# EAGLE design zumo_cc (EAGLE 9.5.2)
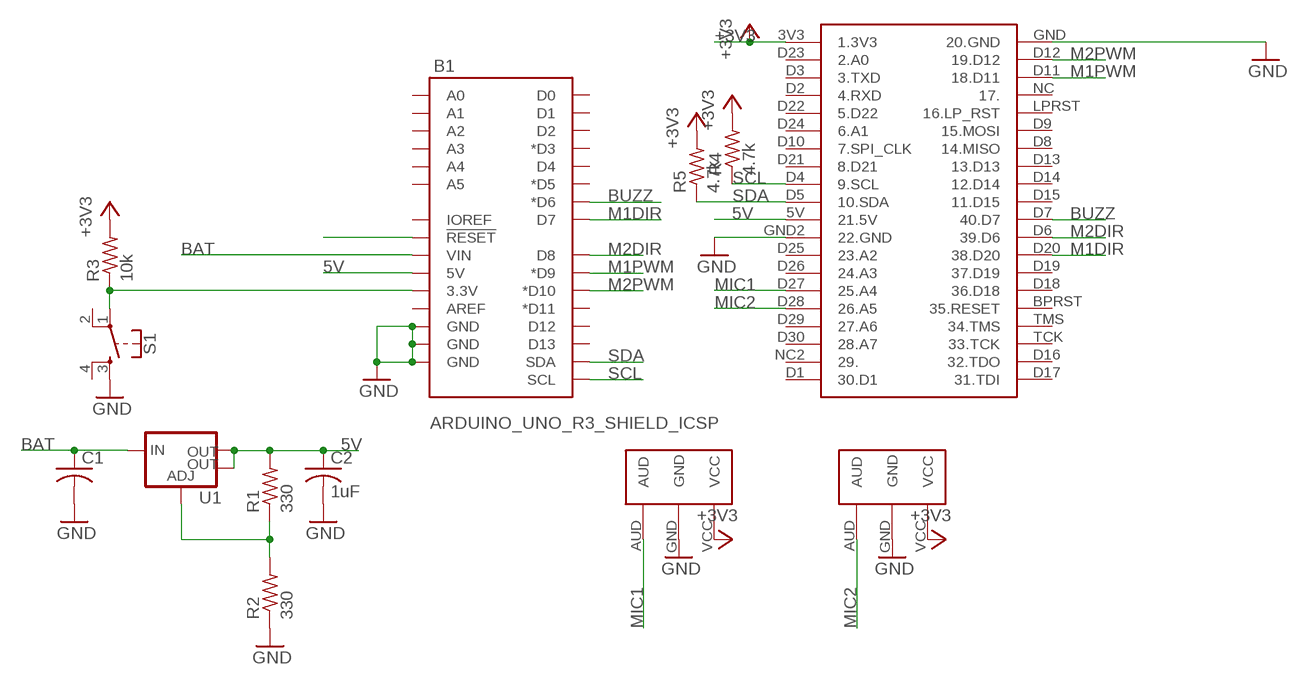
[diagram p0: schematic, sheet 1]

## Parts
B1  ARDUINO_UNO_R3_SHIELD_ICSP  [UNO_R3_SHIELD_ICSP]
C1  1uF  C-USC0603  [C0603]
C2  1uF  C-USC0603  [C0603]
R1  330  R-US_R0603  [R0603]
R2  330  R-US_R0603  [R0603]
R3  10k  R-US_R0603  [R0603]
R4  4.7k  R-US_R0603  [R0603]
R5  4.7k  R-US_R0603  [R0603]
S1  MOMENTARY-SWITCH-SPST-2-SMD-5.2MM  [TACTILE_SWITCH_SMD_5.2MM]
U1  NU32V7_V_REG_LM1117SOT223  [NU32V7_SOT223]
U$1  CC1310_INT  [CC1310_INT]
U$2  ANALOG_MIC  [ANALOG_MIC]
U$3  ANALOG_MIC  [ANALOG_MIC]

## Nets
5V: B1.5V C2.1 R1.2 U1.OUTPUT(OUT) U1.VOUT(OUT) U$1.5V(21.5V)
+3V3: R3.2 R4.2 R5.2 U$1.3V3(1.3V3) U$2.VCC U$3.VCC
BAT: B1.VIN C1.1 U1.INPUT(IN)
BUZZ: B1.D6(*D6) U$1.D7(40.D7)
GND: B1.GND@0(GND) B1.GND@1(GND) B1.GND@2(GND) C1.2 C2.2 R2.1 S1.3 U$1.GND2(22.GND) U$1.GND(20.GND) U$2.GND U$3.GND
M1DIR: B1.D7 U$1.D20(38.D20)
M1PWM: B1.D9(*D9) U$1.D11(18.D11)
M2DIR: B1.D8 U$1.D6(39.D6)
M2PWM: B1.D10(*D10) U$1.D12(19.D12)
MIC1: U$1.D27(25.A4) U$2.AUD
MIC2: U$1.D28(26.A5) U$3.AUD
N$1: B1.3.3V R3.1 S1.1
N$7: B1.RES(!RESET!)
N$17: R1.1 R2.2 U1.GND(ADJ)
SCL: B1.SCL R4.1 U$1.D4(9.SCL)
SDA: B1.SDA R5.1 U$1.D5(10.SDA)
Unconnected: B1.A0 B1.A1 B1.A2 B1.A3 B1.A4 B1.A5 B1.AREF B1.D2 B1.D3(*D3) B1.D4 B1.D5(*D5) B1.D11(*D11) B1.D12 B1.D13 B1.IOREF B1.RX(D0) B1.TX(D1) S1.2 S1.4 U$1.BPRST(35.RESET) U$1.D1(30.D1) U$1.D2(4.RXD) U$1.D3(3.TXD) U$1.D8(14.MISO) U$1.D9(15.MOSI) U$1.D10(7.SPI_CLK) U$1.D13(13.D13) U$1.D14(12.D14) U$1.D15(11.D15) U$1.D16(32.TDO) U$1.D17(31.TDI) U$1.D18(36.D18) U$1.D19(37.D19) U$1.D21(8.D21) U$1.D22(5.D22) U$1.D23(2.A0) U$1.D24(6.A1) U$1.D25(23.A2) U$1.D26(24.A3) U$1.D29(27.A6) U$1.D30(28.A7) U$1.LPRST(16.LP_RST) U$1.NC2(29.) U$1.NC(17.) U$1.TCK(33.TCK) U$1.TMS(34.TMS)

## Library data of the parts
B1 = Swarm:ARDUINO_UNO_R3_SHIELD_ICSP: Arduino R3 Shield Footprint with ICSP Header Includes pins for 6-pin (2x3) ICSP Header. Compatible with Leonardo boards that require SPI pin connections via this header. SparkFun Products: CryptoShield <https://www.sparkfun.com/products/13183> microSD Shield <https://www.sparkfun.com/products/12761> R3 Stackable Headers Kit <https://www.sparkfun.com/products/1417>
C1 C2 = Swarm:C-US: CAPACITOR, American symbol; SPICEPREFIX: C
R1-R5 = Swarm:R-US_: RESISTOR, American symbol; SPICEPREFIX: R
S1 = Swarm:MOMENTARY-SWITCH-SPST-2: Momentary Switch (Pushbutton) - SPST - Two Circuits Normally-open (NO) SPST momentary switches (buttons, pushbuttons). Schematic symbol includes two switch circuits. Variants SMD-4.6MMX2.8MM - 4.60mm x 2.80mm Tactile Momentary Button Switch - Used on SparkFun SAMD21 Mini Breakout <https://www.sparkfun.com/products/13664> SMD-5.2MM - Mini Pushbutton Switch - SMD <https://www.sparkfun.com/products/8720> - Used on Arduino Pro Mini <https://www.sparkfun.com/products/11114>; PROD_ID: SWCH-08247; SF_SKU: COM-08720
U1 = Swarm:NU32V7_V_REG_LM1117: Voltage Regulator LM1117 Standard adjustable voltage regulator but in SMD form. Spark Fun Electronics SKU : COM-00595; PROD_ID: VREG-08170
U$1 = Swarm:CC1310_INT
U$2 U$3 = Swarm:ANALOG_MIC

## Board
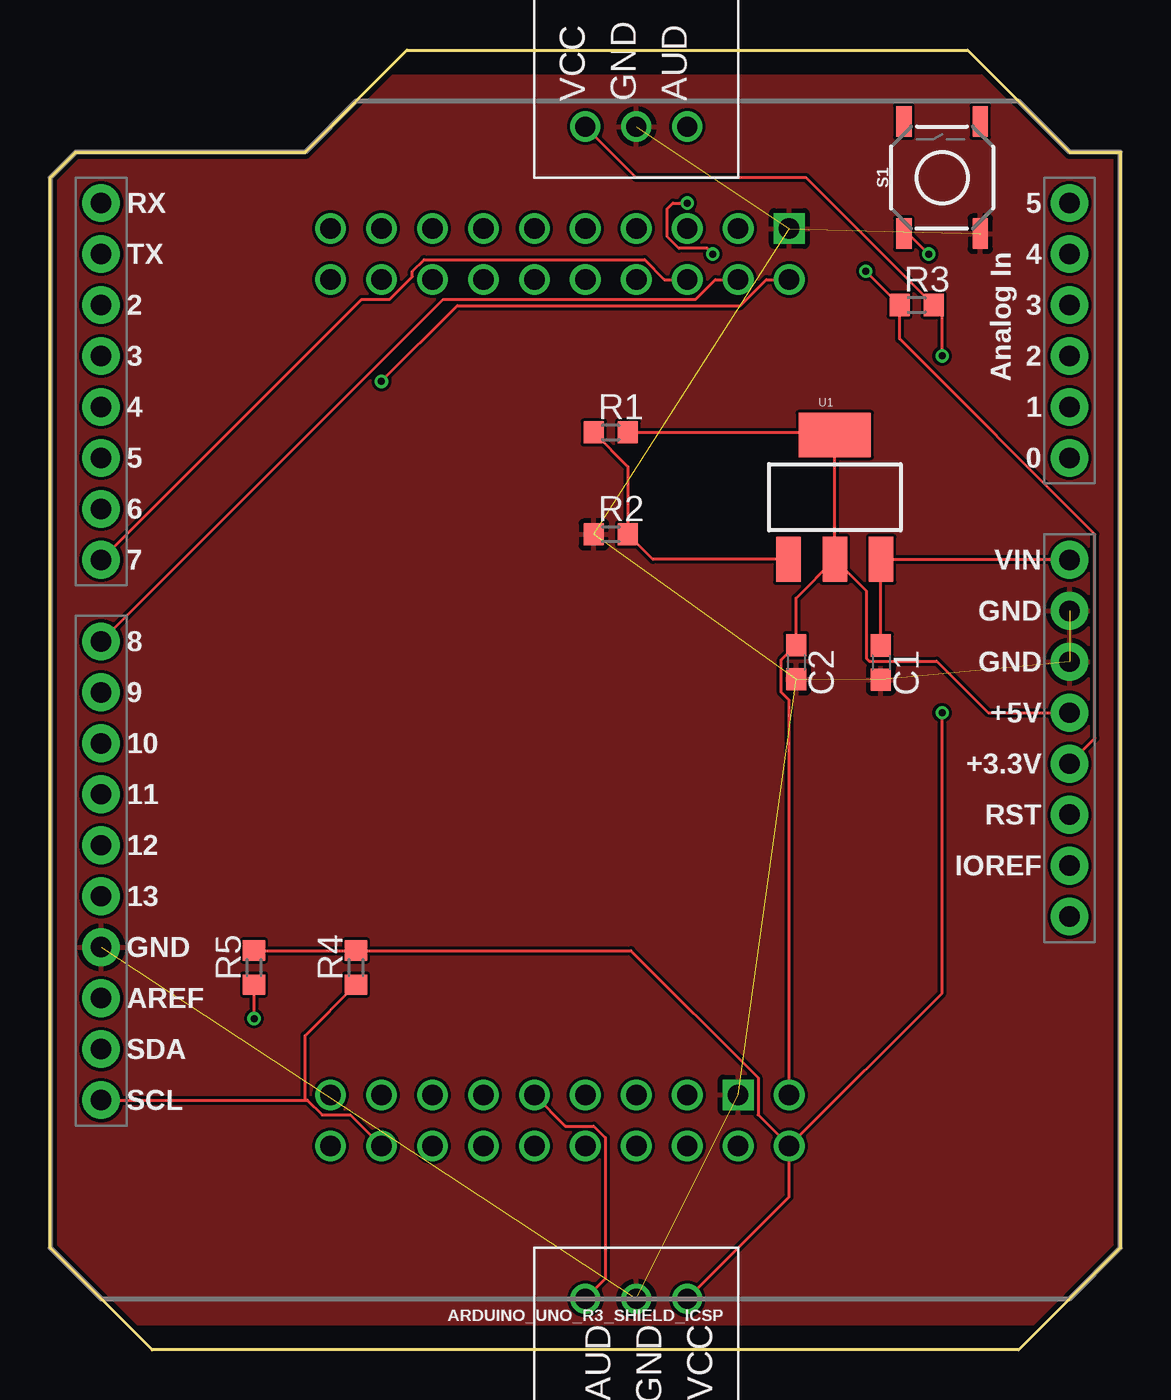
[diagram p1: board, top side]
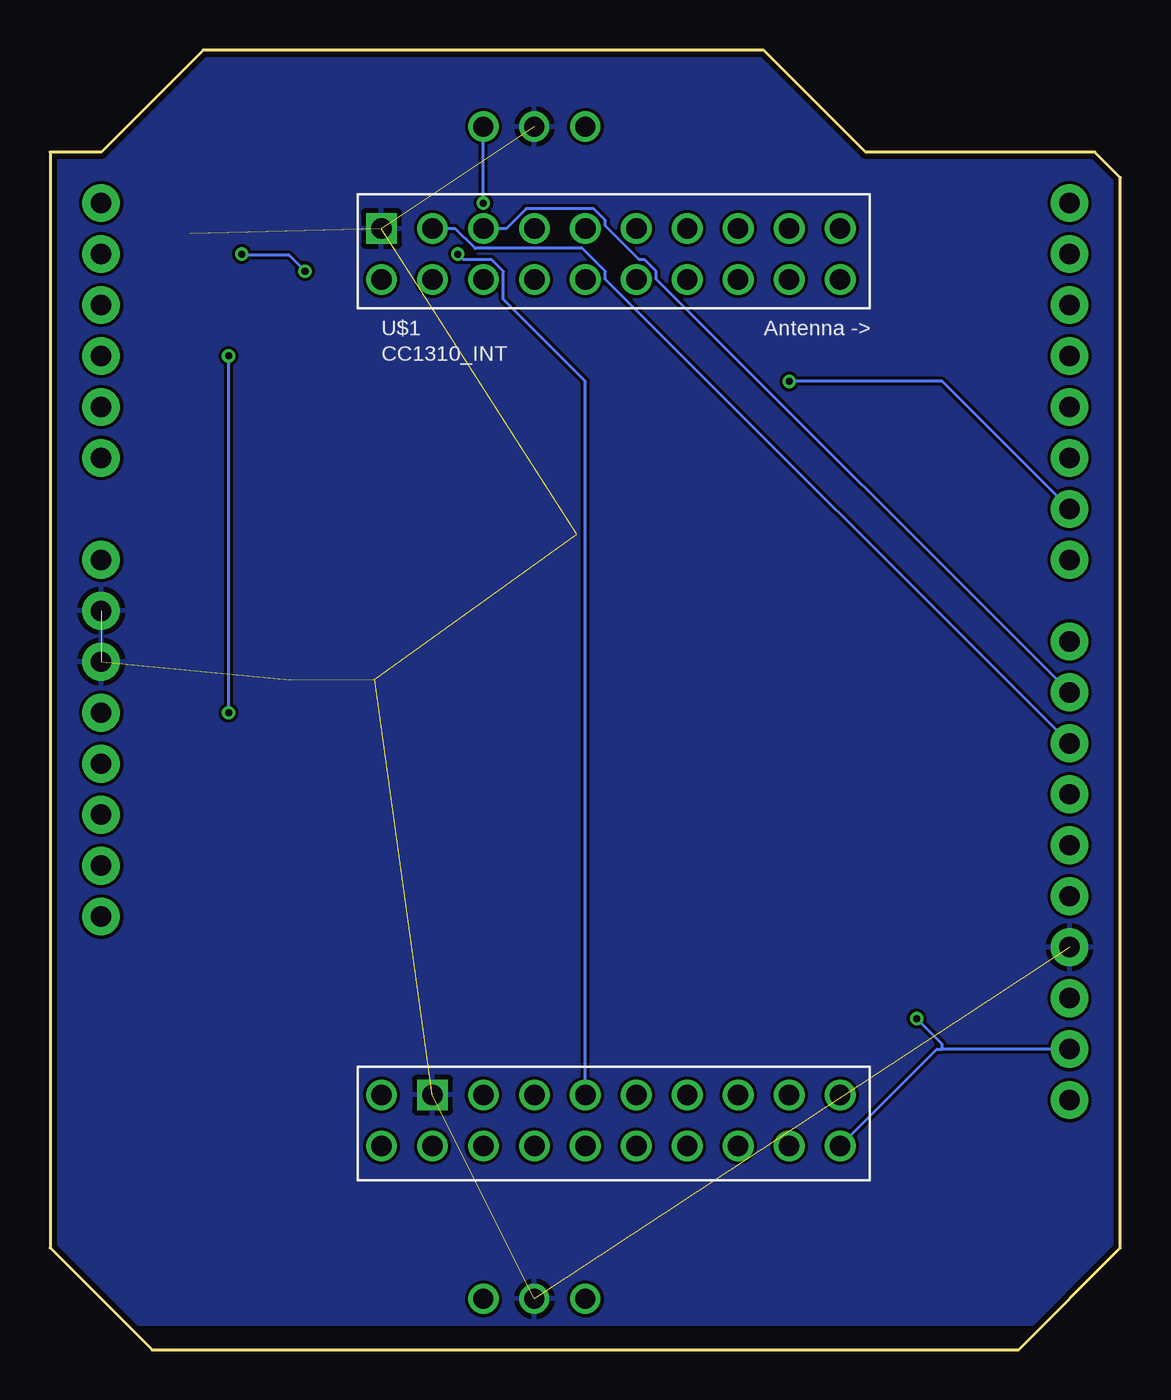
[diagram p2: board, bottom side, seen from below]

Size 53.34 x 64.77 mm. Coordinates in mm from the lower left corner, seen from the top.
Outline: 0,5.08 0,58.42 1.27,59.69 12.7,59.69 17.78,64.77 45.72,64.77 50.8,59.69 53.34,59.69 53.34,5.08 48.26,0 5.08,0 0,5.08
Copper layers (1*16): Top 0.035mm / dielectric 1.5mm / Bottom 0.035mm
Design rules "SeedStudio2Layer": minimum track width 6mil, minimum drill 12mil, track to track 6mil, track to pad 6mil, pad to pad 6mil, via to via 6mil, smd to smd 0mil, copper to edge 10mil, drill to drill 10mil, minimum pad ring 10mil, minimum via ring 6mil, stop-mask expansion 2mil, vias tented up to drill 100mil, thermal gap 10mil

### Footprints (pad centres in the part's own frame; a part is rotated, then mirrored left to right if it is on the bottom)
UNO_R3_SHIELD_ICSP = drill 1.016 pad 1.88: 3.3V 24.13,-3.81; 5V 24.13,-1.27; A0 24.13,11.43; A1 24.13,13.97; A2 24.13,16.51; A3 24.13,19.05; A4 24.13,21.59; A5 24.13,24.13; AREF -24.13,-15.494; D2 -24.13,19.05; D3 -24.13,16.51; D4 -24.13,13.97; D5 -24.13,11.43; D6 -24.13,8.89; D7 -24.13,6.35; D8 -24.13,2.286; D9 -24.13,-0.254; D10 -24.13,-2.794; D11 -24.13,-5.334; D12 -24.13,-7.874; D13 -24.13,-10.414; GND@0 24.13,1.27; GND@1 24.13,3.81; GND@2 -24.13,-12.954; IOREF 24.13,-8.89; NC 24.13,-11.43; RES 24.13,-6.35; RX -24.13,24.13; SCL -24.13,-20.574; SDA -24.13,-18.034; TX -24.13,21.59; VIN 24.13,6.35
C0603 = smd 1.1 x 1: 1 -0.85,0; 2 0.85,0
R0603 = smd 1 x 1.1: 1 -0.85,0; 2 0.85,0
TACTILE_SWITCH_SMD_5.2MM = smd 1.524 x 0.762: 1 -2.794,1.905; 2 2.794,1.905; 3 -2.794,-1.905; 4 2.794,-1.905
NU32V7_SOT223 = smd 1.219 x 2.235: GND -2.311,-3.099; INPUT 2.311,-3.099; OUTPUT 0,-3.099 | smd 3.6 x 2.2: VOUT 0,3.099
CC1310_INT = drill 1.02: 3V3 -10.16,-22.86; 5V -10.16,-20.32; BPRST 2.54,20.32; D1 12.7,-20.32; D2 -2.54,-22.86; D3 -5.08,-22.86; D4 10.16,-22.86; D5 12.7,-22.86; D6 -7.62,20.32; D7 -10.16,20.32; D8 5.08,22.86; D9 2.54,22.86; D10 5.08,-22.86; D11 -5.08,22.86; D12 -7.62,22.86; D13 7.62,22.86; D14 10.16,22.86; D15 12.7,22.86; D16 10.16,20.32; D17 12.7,20.32; D18 0,20.32; D19 -2.54,20.32; D20 -5.08,20.32; D21 7.62,-22.86; D22 0,-22.86; D23 -7.62,-22.86; D24 2.54,-22.86; D25 -5.08,-20.32; D26 -2.54,-20.32; D27 0,-20.32; D28 2.54,-20.32; D29 5.08,-20.32; D30 7.62,-20.32; LPRST 0,22.86; NC -2.54,22.86; NC2 10.16,-20.32; TCK 7.62,20.32; TMS 5.08,20.32 | drill 1.02 square: GND -10.16,22.86; GND2 -7.62,-20.32
ANALOG_MIC = drill 1: AUD 5.08,0; GND 2.54,0; VCC 0,0

### Placement (x,y rotation side)
B1  26.67,33.02 0 top
C1  41.4,34.25 270 top
C2  37.17,34.26 270 top
R1  27.94,45.72 0 top
R2  27.94,40.64 0 top
R3  43.18,52.07 0 top
R4  15.24,19.05 90 top
R5  10.16,19.05 90 top
S1  44.45,58.42 90 top
U1  39.1,42.49 0 top
U$1  26.67,33.02 0 bottom
U$2  26.67,60.96 0 top
U$3  31.75,2.54 180 top

### Tracks (layer width: path | path; a pad name or v marks a point on that pad's centre or on a via)
5V
  Top 0.152: U1.OUTPUT 37.17,37.46 C2.1 36.44,34.39 36.44,32.77 36.83,32.38 U$1.5V | R1.2 38.98,45.72 U1.VOUT U1.OUTPUT | B1.5V 46.75,31.75 44.17,34.32 40.81,34.32 40.67,34.46 40.67,37.82 U1.OUTPUT
+3V3  (via drill 0.35)
  Top 0.152: R5.2 R4.2 28.94,19.9 35.28,13.56 35.28,11.71 U$1.3V3 | U$1.3V3 44.45,17.78 v44.45,31.75 | v44.45,49.53 44.45,51.65 R3.2 37.68,58.42 29.21,58.42 U$2.VCC | U$3.VCC 36.83,7.62 U$1.3V3
  Bottom 0.152: v44.45,31.75 v44.45,49.53
BAT
  Top 0.152: B1.VIN 41.91,39.37 | 41.91,39.37 41.44,39.37 U1.INPUT | C1.1 41.4,38.86 41.91,39.37
BUZZ  (via drill 0.35)
  Top 0.152: v16.51,48.26 20.29,52.04 34.4,52.04 35.7,53.34 U$1.D7
  Bottom 0.152: B1.D6 8.89,48.26 v16.51,48.26
GND  (10 unrouted)
  pour Top: 0,59.69 12.7,59.69 16.51,63.5 48.26,63.5 50.8,60.96 53.34,60.96 54.61,59.69 54.61,1.27 48.26,1.27 2.54,1.27 -1.27,5.08 -1.27,58.42
  pour Bottom: 1.27,60.96 13.97,60.96 17.78,64.77 52.07,64.77 55.88,60.96 55.88,2.54 54.61,1.27 45.72,1.27 1.27,1.27 -1.27,3.81 -1.27,59.69 0,60.96
M1DIR
  Top 0.152: B1.D7 15.52,52.35 16.92,52.35 18.06,53.48 18.06,53.75 18.64,54.33 29.62,54.33 30.61,53.34 U$1.D20
M1PWM
  Bottom 0.152: B1.D9 23.14,53.36 23.14,53.75 23.72,54.33 23.99,54.33 25.68,56.02 25.68,56.29 26.26,56.87 29.62,56.87 30.61,55.88 U$1.D11
M2DIR
  Top 0.152: U$1.D6 33.16,53.34 32.16,52.35 19.58,52.35 B1.D8
M2PWM
  Bottom 0.152: B1.D10 25.68,53.36 25.68,53.75 26.81,54.89 32.16,54.89 33.16,55.88 U$1.D12
MIC1  (via drill 0.35)
  Top 0.152: v33.02,54.61 32.74,54.89 31.34,54.89 30.76,55.47 30.76,56.87 31.03,57.15 v31.75,57.15
  Bottom 0.152: U$1.D27 26.67,48.26 30.76,52.35 30.76,53.75 31.34,54.33 32.74,54.33 v33.02,54.61 | v31.75,57.15 U$2.AUD
MIC2
  Top 0.152: U$1.D28 25.68,11.15 27.08,11.15 27.66,10.57 27.66,3.53 U$3.AUD
N$1  (via drill 0.35)
  Top 0.152: B1.3.3V 52.07,30.48 52.07,40.64 42.33,50.38 R3.1 40.66,53.73 40.66,53.76 v40.64,53.76 | v43.79,54.61 42.77,55.63 S1.1
  Bottom 0.152: v40.64,53.76 41.43,54.55 43.79,54.55 v43.79,54.61
N$17
  Top 0.152: U1.GND 30.04,39.39 R2.2 28.79,44.02 R1.1
SCL
  Top 0.152: B1.SCL 12.7,12.45 | 12.7,12.45 12.82,12.45 13.56,11.71 14.96,11.71 U$1.D4 | 12.7,12.45 12.7,15.66 R4.1
SDA  (via drill 0.35)
  Top 0.152: v10.16,16.51 R5.1
  Bottom 0.152: B1.SDA 8.89,14.99 | 8.89,14.99 9.14,14.99 U$1.D5 | 8.89,14.99 8.89,15.24 v10.16,16.51